# Altium schematic sheet Telemetry_SCH.SchDoc
size 381 x 241 mm; SheetNumber: 1; SheetTotal: 3
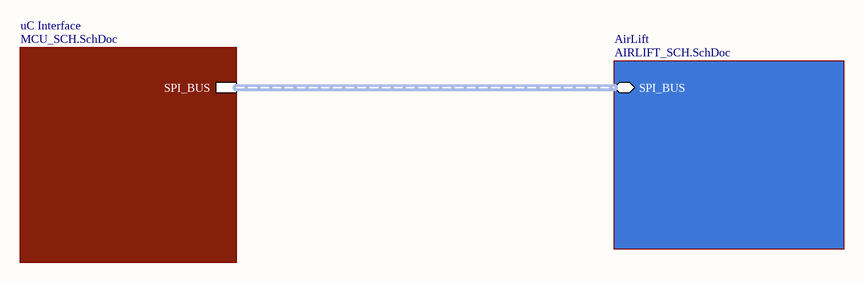
[diagram p0: Telemetry_SCH.SchDoc]

## Sub-sheets
AirLift = AIRLIFT_SCH.SchDoc: SPI_BUS (bidir, harness SPI_BUS)
uC Interface = MCU_SCH.SchDoc: SPI_BUS (harness SPI_BUS)

## Buses and harness runs
harness sheet AirLift/SPI_BUS = sheet uC Interface/SPI_BUS